# EAGLE design module_RF69 (EAGLE 8.4.0)
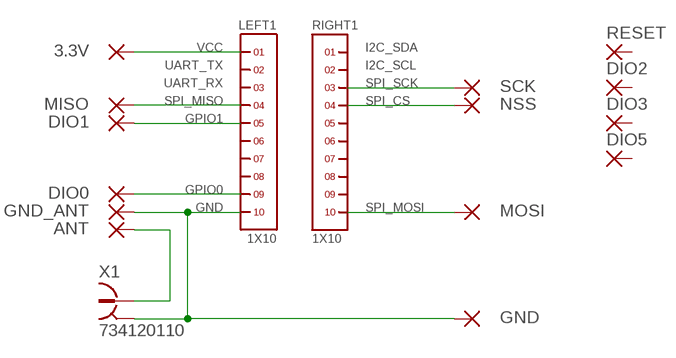
[diagram p0: schematic, sheet 1]

## Parts
3.3V  SMD2  [SMD1,27-2,54]
ANT  SMD2  [SMD1,27-2,54]
DIO0  SMD2  [SMD1,27-2,54]
DIO1  SMD2  [SMD1,27-2,54]
DIO2  SMD2  [SMD1,27-2,54]
DIO3  SMD2  [SMD1,27-2,54]
DIO5  SMD2  [SMD1,27-2,54]
GND  SMD2  [SMD1,27-2,54]
GND_ANT  SMD2  [SMD1,27-2,54]
LEFT1  1X10  [1X10]
MISO  SMD2  [SMD1,27-2,54]
MOSI  SMD2  [SMD1,27-2,54]
NSS  SMD2  [SMD1,27-2,54]
RESET  SMD2  [SMD1,27-2,54]
RIGHT1  1X10  [1X10]
SCK  SMD2  [SMD1,27-2,54]
X1  734120110  [734120110]

## Nets
ANT: ANT.1(P) X1.1
GND: GND.1(P) GND_ANT.1(P) LEFT1.10 X1.S@1 X1.S@2 X1.S@3
INT0: DIO0.1(P) LEFT1.9
INT1: DIO1.1(P) LEFT1.5
SPI_CS: NSS.1(P) RIGHT1.4
SPI_MISO: LEFT1.4 MISO.1(P)
SPI_MOSI: MOSI.1(P) RIGHT1.10
SPI_SCK: RIGHT1.3 SCK.1(P)
VCC: 3.3V.1(P) LEFT1.1
Unconnected: DIO2.1(P) DIO3.1(P) DIO5.1(P) LEFT1.2 LEFT1.3 LEFT1.6 LEFT1.7 LEFT1.8 RESET.1(P) RIGHT1.1 RIGHT1.2 RIGHT1.5 RIGHT1.6 RIGHT1.7 RIGHT1.8 RIGHT1.9

## Notes on the sheet
- VCC | I2C_SDA
- UART_TX | I2C_SCL
- UART_RX | SPI_SCK
- SPI_MISO | SPI_CS
- GPIO1
- GPIO0
- GND | SPI_MOSI

## Library data of the parts
3.3V ANT DIO0 DIO1-DIO3 DIO5 GND GND_ANT MISO MOSI NSS RESET SCK = wirepad:SMD2: SMD PAD
LEFT1 RIGHT1 = headers(2mm):1X10
X1 = con-coax:734120110: MICRO COAXIAL CONNECTOR RECEPTACLE VERTICAL Source: Data sheet <http://www.molex.com/pdm_docs/sd/734120110_sd.pdf>

## Board
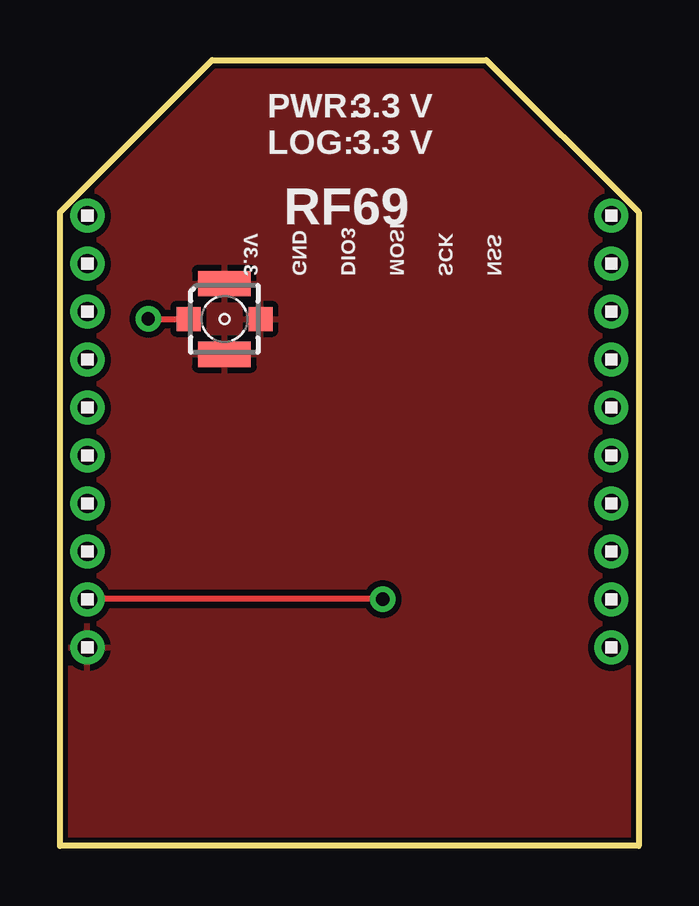
[diagram p1: board, top side]
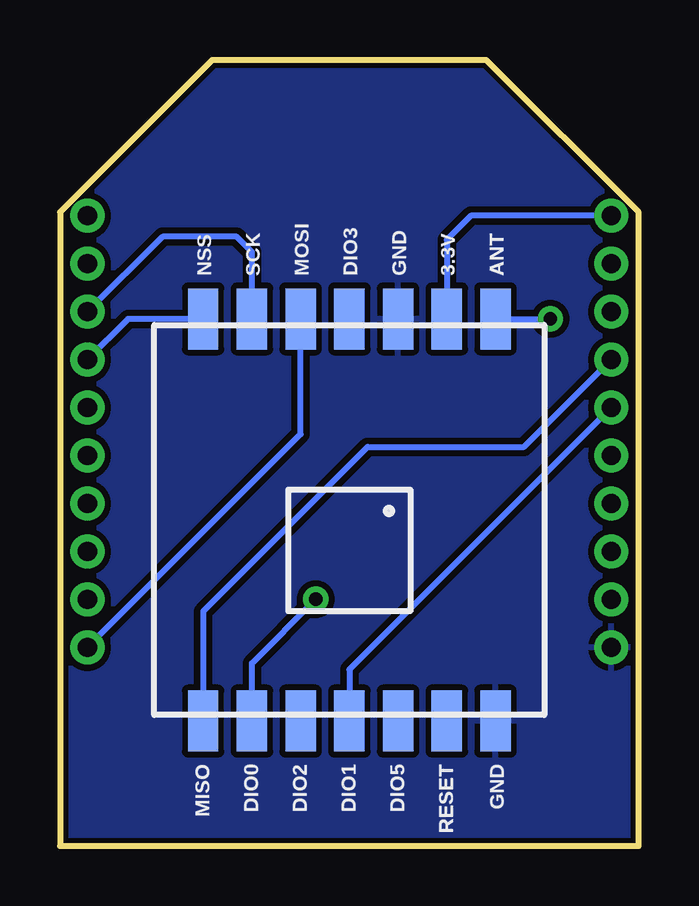
[diagram p2: board, bottom side, seen from below]

Size 24.13 x 32.77 mm. Coordinates in mm from the lower left corner, seen from the top.
Outline: 0,0 0,26.42 6.35,32.77 17.78,32.77 24.13,26.42 24.13,0 0,0
Copper layers (1*16): Top 0.035mm / dielectric 1.5mm / Bottom 0.035mm
Design rules "SparkFun-2-layer-STANDARD": minimum track width 10mil, minimum drill 20mil, track to track 10mil, track to pad 8mil, pad to pad 8mil, via to via 10mil, smd to smd 8mil, copper to edge 8mil, drill to drill 8mil, minimum pad ring 10mil, minimum via ring 10mil, stop-mask expansion 4mil, vias tented up to drill 25mil, thermal gap 10mil

### Footprints (pad centres in the part's own frame; a part is rotated, then mirrored left to right if it is on the bottom)
SMD1,27-2,54 = smd 1.27 x 2.54: 1 0,0
1X10 = drill 0.8 pad 1.422: 1 -9,0; 2 -7,0; 3 -5,0; 4 -3,0; 5 -1,0; 6 1,0; 7 3,0; 8 5,0; 9 7,0; 10 9,0
734120110 = smd 1 x 1: 1 0,-1.5; S@1 0,1.5 | smd 1.05 x 2.2: S@2 -1.475,0; S@3 1.475,0

### Placement (x,y rotation side)
3.3V  8,21.97 0 bottom
ANT  5.97,21.97 0 bottom
DIO0  16.13,5.21 0 bottom
DIO1  12.06,5.21 0 bottom
DIO2  14.1,5.21 0 bottom
DIO3  12.06,21.97 0 bottom
DIO5  10.03,5.21 0 bottom
GND  10.03,21.97 0 bottom
GND_ANT  5.97,5.21 0 bottom
LEFT1  1.14,17.27 270 top
MISO  18.16,5.21 0 bottom
MOSI  14.1,21.97 0 bottom
NSS  18.16,21.97 0 bottom
RESET  8,5.21 0 bottom
RIGHT1  22.99,17.27 270 top
SCK  16.13,21.97 0 bottom
X1  6.86,21.97 270 top

### Tracks (layer width: path | path; a pad name or v marks a point on that pad's centre or on a via)
ANT  (via drill 0.55)
  Top 0.254: v3.68,21.97 X1.1
  Bottom 0.254: ANT.1 v3.68,21.97
GND
  pour Bottom: -0.51,-0.51 -0.51,26.67 6.1,33.27 18.03,33.27 24.64,26.67 24.64,-0.51
  pour Top: -0.25,-0.25 -0.25,26.54 6.22,33.02 17.91,33.02 24.38,26.54 24.38,-0.25
INT0  (via drill 0.55)
  Top 0.254: v13.46,10.29 1.16,10.29 LEFT1.9
  Bottom 0.254: DIO0.1 16.13,7.62 v13.46,10.29
INT1
  Bottom 0.254: LEFT1.5 12.06,7.35 DIO1.1
SPI_CS
  Bottom 0.254: NSS.1 21.29,21.97 RIGHT1.4
SPI_MISO
  Bottom 0.254: MISO.1 18.16,9.78 11.3,16.64 4.78,16.64 LEFT1.4
SPI_MOSI
  Bottom 0.254: RIGHT1.10 14.1,17.16 MOSI.1
SPI_SCK
  Bottom 0.254: SCK.1 16.13,24.77 16.76,25.4 19.86,25.4 RIGHT1.3
VCC
  Bottom 0.254: LEFT1.1 7,26.27 8,25.27 3.3V.1

### Text on the board
_tNames: PWR: / LOG: | 3.3 V / 3.3 V | RF69 | 3.3V | GND | DIO3 | MOSI | SCK | NSS
_bNames: ANT | GND | RESET | DIO5 | DIO1 | DIO2 | DIO0 | MISO
HeatSink: RF69